# Altium project OpampOne.PrjPcb
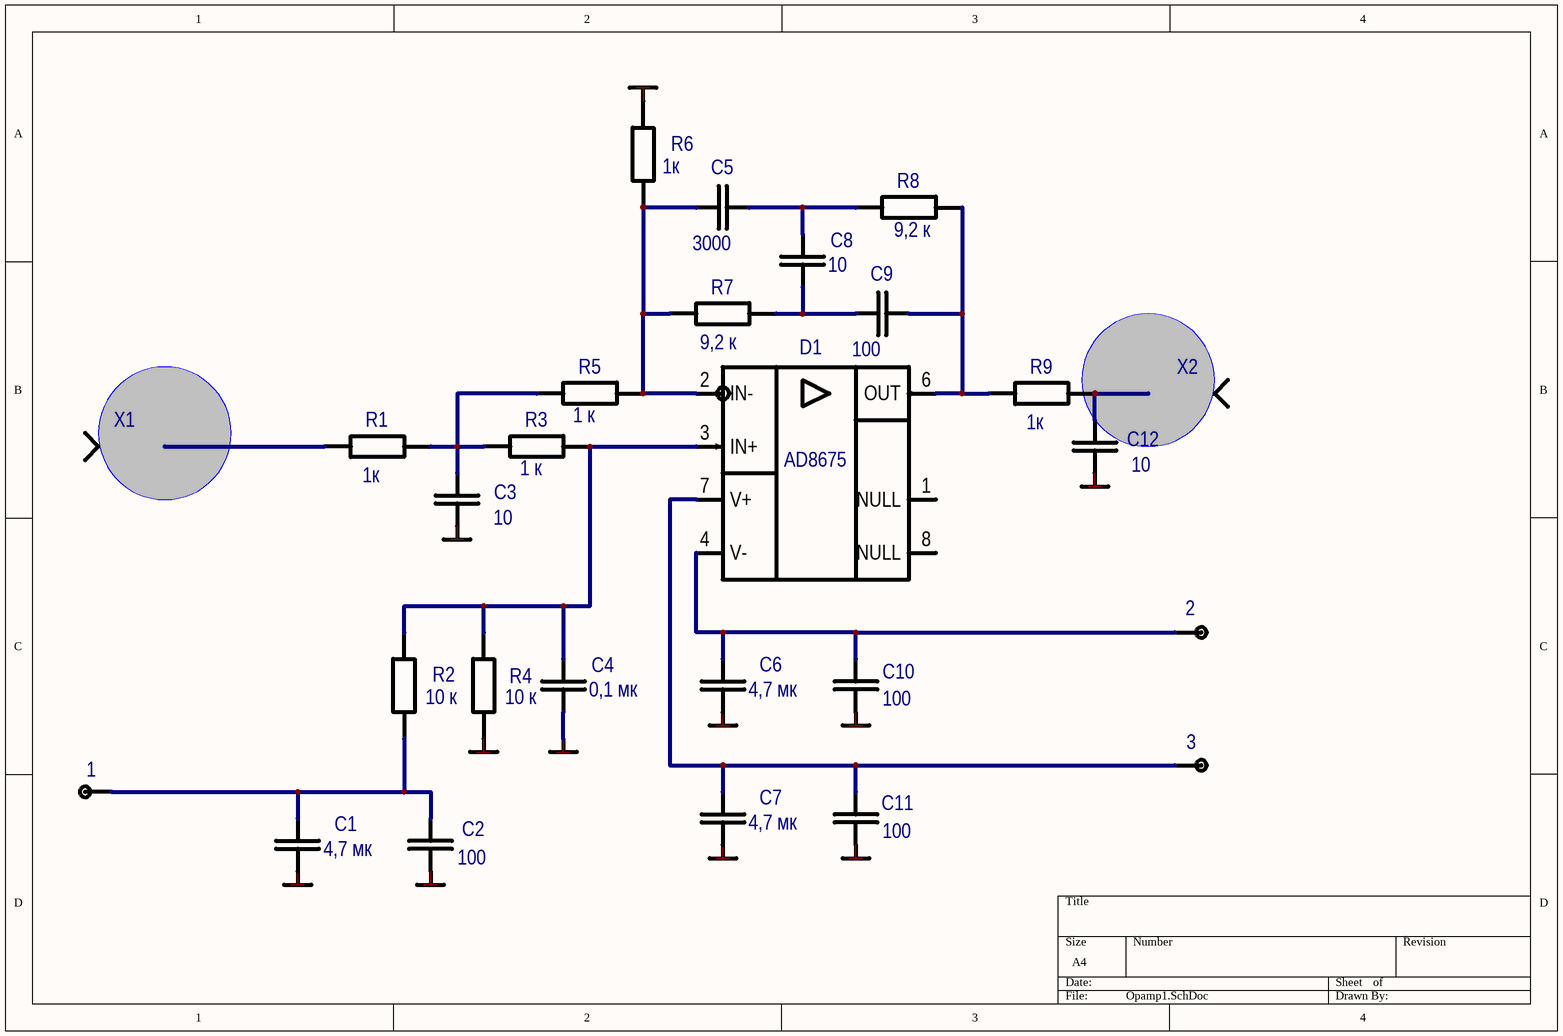
[diagram p0: Opamp1.SchDoc]
1 sheet, 38 parts. Net scope: global (net labels, ports and power ports of the same name join across sheets).
Board file: OpAmpPCB1.PcbDoc

## Sheet Opamp1.SchDoc
size A4; SheetNumber: 1; SheetTotal: 1

### Parts
(Parts that share a designator on the sheet are numbered #1, #2 ... from top to bottom, then left to right.)
1  TP  [TP1]  (value not drawn)  (no BOM)
2  TP  [TP1]  (value not drawn)  (no BOM)
3  TP  [TP1]  (value not drawn)  (no BOM)
*#1  GND  (value not drawn)  (graphical)
*#2  GND  (value not drawn)  (graphical)
*#3  GND  (value not drawn)  (graphical)
*#4  GND  (value not drawn)  (graphical)
*#5  GND  (value not drawn)  (graphical)
*#6  GND  (value not drawn)  (graphical)
*#7  GND  (value not drawn)  (graphical)
*#8  GND  (value not drawn)  (graphical)
*#9  GND  (value not drawn)  (graphical)
*#10  GND  (value not drawn)  (graphical)
*#11  GND  (value not drawn)  (graphical)
C1  4,7 мк  [CAPC2012N]
C2  100  [CAPC1005N]
C3  10  [CAPC1608L]
C4  0,1 мк  [CAPC1005L]
C5  3000  [CAPC1608L]
C6  4,7 мк  [CAPC2012N]
C7  4,7 мк  [CAPC2012N]
C8  10  [CAPC1005L]
C9  100  [CAPC1608L]
C10  100  [CAPC1005N]
C11  100  [CAPC1005N]
C12  10  [CAPC1608N]
D1  AD8675ARZ  [SOIC127P600-8M]  (value not drawn)
R1  1к  [RESC1608L]
R2  10 к  [RESC1005L]
R3  1 к  [RESC1005L]
R4  10 к  [RESC1005L]
R5  1 к  [RESC1005L]
R6  1к  [RESC1608L]
R7  9,2 к  [RESC1608L]
R8  9,2 к  [RESC1608L]
R9  1к  [RESC1608L]
X1  СРГ-50-751ФВ  [TP0.6X1]  (value not drawn)
X2  СРГ-50-751ФВ  [TP0.6X1]  (value not drawn)

### Nets
GND: C1.1 C2.2 C3.1 C4.1 C6.1 C7.1 C10.2 C11.2 C12.1 R4.1 R6.2
Net1_1: 1.1 C1.2 C2.1 R2.1
Net2_1: 2.1 C6.2 C10.1 D1.4(V-)
Net3_1: 3.1 C7.2 C11.1 D1.7(V+)
NetC3_2: C3.2 R1.1 R3.1 R5.1
NetC4_2: C4.2 D1.3(IN+) R2.2 R3.2 R4.2
NetC5_1: C5.1 D1.2(IN-) R5.2 R6.1 R7.1
NetC5_2: C5.2 C8.2 R8.1
NetC8_1: C8.1 C9.1 R7.2
NetC9_2: C9.2 D1.6(OUT) R8.2 R9.2
NetC12_2: C12.2 R9.1 X2.1
NetR1_2: R1.2 X1.1

Not connected (* = marked no-connect by the designer): D1 1(NULL) 8(NULL)

### Notes on the sheet
- (in symbol AD8675ARZ) AD8675

### Library data of the parts
1-3 = TP: Test point
*#1-*#11 = GND: Корпус ЕСКД. Для "наложения" на штатный Power Bar
C1 C6 C7 = C0805: Чип-конденсатор; Name: 0805; Power/Voltage: {Voltage}; TKE/TKC: {TKE/TKC}; Tolerance: {Tolerance}; Value: {Value}; BCPId: *; Manufacturer: *; ManufacturerPartNumber: *; Type: Конденсатор
C2 C10 C11 = C0402: Чип-конденсатор; Name: 0402; Power/Voltage: {Voltage}; TKE/TKC: {TKE/TKC}; Tolerance: {Tolerance}; Value: {Value}; BCPId: *; Manufacturer: *; ManufacturerPartNumber: *; Type: Конденсатор
C3 C5 C9 C12 = C0603: Чип-конденсатор; Name: 0603; Power/Voltage: {Voltage}; TKE/TKC: {TKE/TKC}; Tolerance: {Tolerance}; Value: {Value}; BCPId: *; Manufacturer: *; ManufacturerPartNumber: *; Type: Конденсатор
C4 = C0402: Чип-конденсатор; Name: 0402; Power/Voltage: {Voltage}; TKE/TKC: {TKE/TKC}; Tolerance: {Tolerance}; Value: 10; BCPId: *; Manufacturer: *; ManufacturerPartNumber: *; Type: Конденсатор
C8 = C0402: Чип-конденсатор; Name: 0402; Power/Voltage: {Voltage}; TKE/TKC: {TKE/TKC}; Tolerance: {Tolerance}; BCPId: *; Manufacturer: *; ManufacturerPartNumber: *; Type: Конденсатор; Value: 10
D1 = AD8675ARZ: 36 V Precision, 2.8 nV/√Hz  Rail-to-Rail Output Op Amp; Manufacturer: Analog Devices; Type: Микросхема; BCPId: *; Name: *; Package: R-8; ManufacturerPartNumber: AD8675ARZ
R1 R6-R9 = R0603: Чип-резистор; Name: 0603; Tolerance: {Tolerance}; Value: {Value}; BCPId: *; Manufacturer: *; ManufacturerPartNumber: *; Type: Резистор
R2-R5 = R0402: Чип-резистор; Name: 0402; Tolerance: {Tolerance}; Value: {Value}; BCPId: *; Manufacturer: *; ManufacturerPartNumber: *; Type: Резистор
X1 X2 = СРГ-50-751ФВ: Переход; TU/GOST: ВР0.364.049 ТУ; BCPId: *; Name: *; ManufacturerPartNumber: СРГ-50-751ФВ; Type: Переход